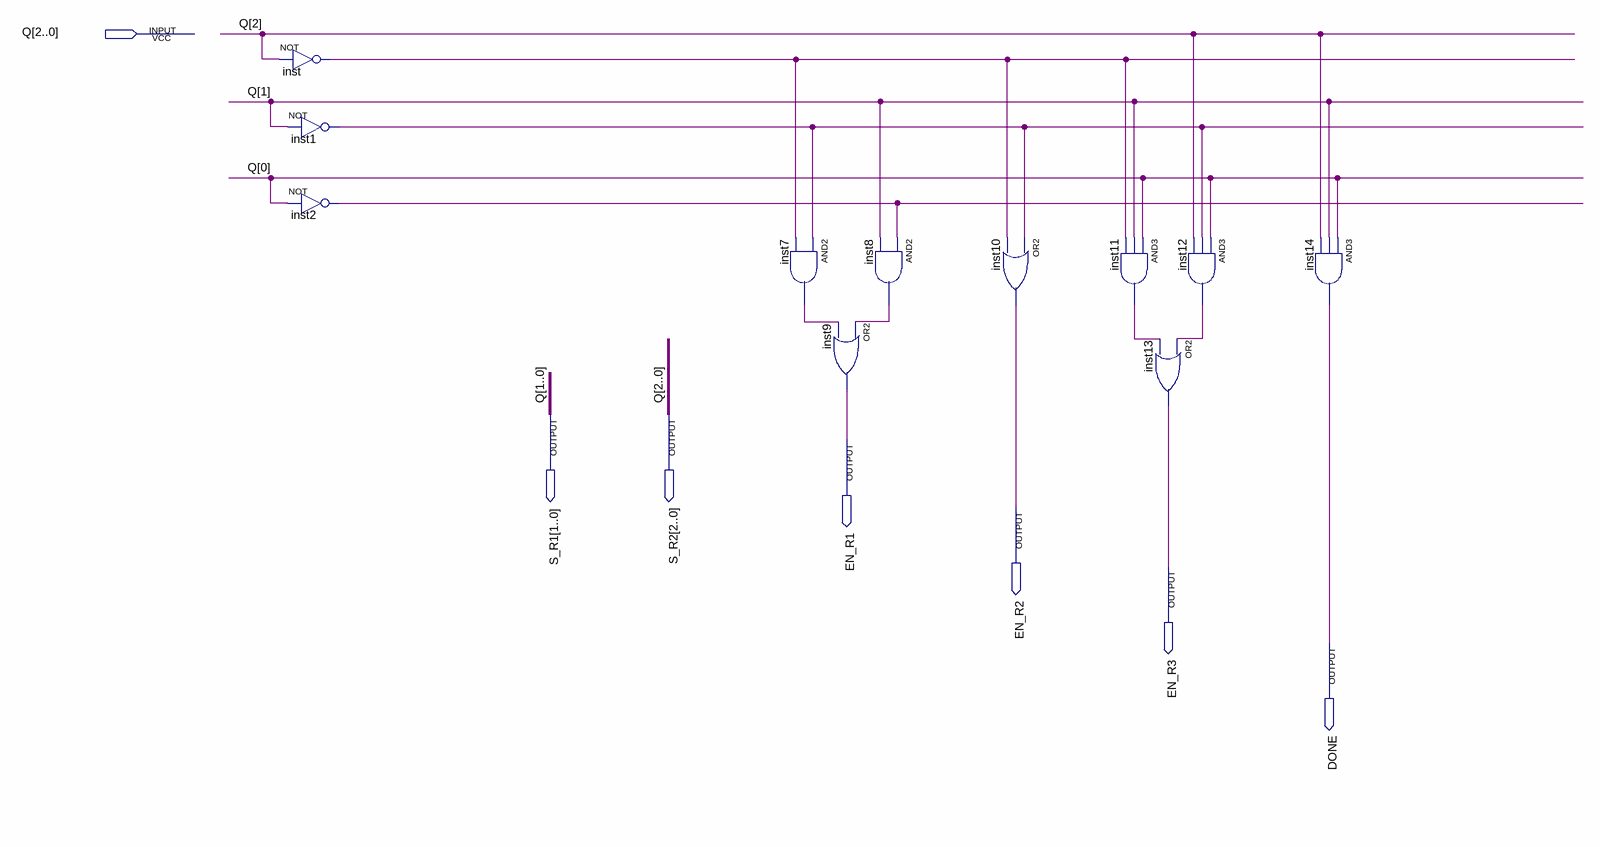
[diagram p0: schematic sheet]
// Quartus schematic OUTPUT_ENCODER.bdf as structural Verilog: 11 symbols, 7 pins
module OUTPUT_ENCODER (
  input  [2:0] Q,
  output [1:0] S_R1,
  output [2:0] S_R2,
  output EN_R1,
  output EN_R2,
  output EN_R3,
  output DONE
);

  wire inst1_out, inst2_out, inst7_out, inst8_out, inst11_out, inst12_out, inst_out;

  not inst (inst_out, Q[2]);
  not inst1 (inst1_out, Q[1]);
  not inst2 (inst2_out, Q[0]);
  and inst7 (inst7_out, inst1_out, inst_out);
  and inst8 (inst8_out, inst2_out, Q[1]);
  or inst9 (EN_R1, inst8_out, inst7_out);
  or inst10 (EN_R2, inst1_out, inst_out);
  and inst11 (inst11_out, Q[0], Q[1], inst_out);
  and inst12 (inst12_out, Q[0], inst1_out, Q[2]);
  or inst13 (EN_R3, inst12_out, inst11_out);
  and inst14 (DONE, Q[0], Q[1], Q[2]);

  assign S_R1 = Q[1:0];
  assign S_R2 = Q;
endmodule
